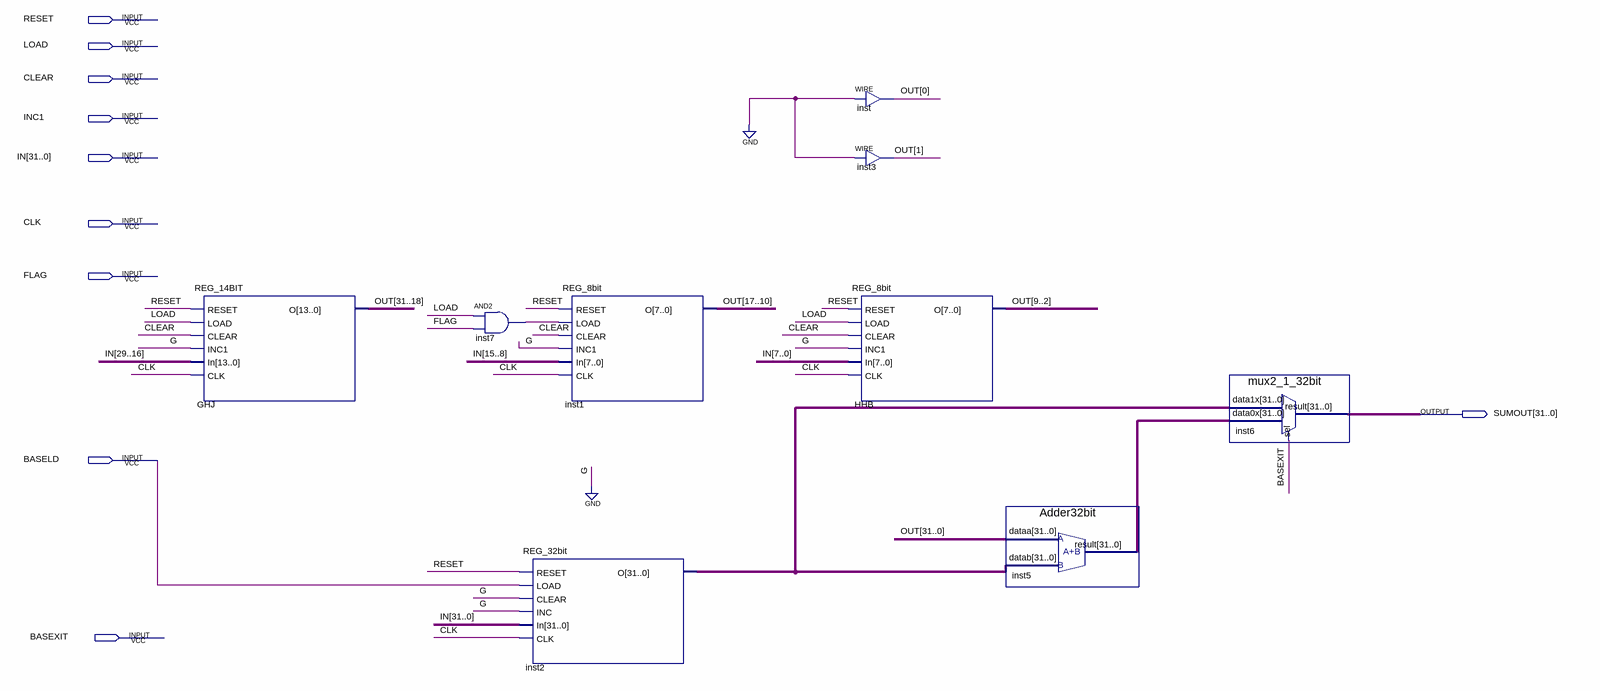
[diagram p0: schematic sheet]
// Quartus schematic LV.bdf as structural Verilog: 9 symbols, 10 pins
module LV (
  input  RESET,
  input  LOAD,
  input  CLEAR,
  input  INC1,
  input  [31:0] IN,
  input  CLK,
  input  FLAG,
  input  BASELD,
  input  BASEXIT,
  output [31:0] SUMOUT
);

  wire inst7_out;
  wire [31:0] inst2_o, inst5_result, OUT;

  REG_14BIT GHJ (.RESET(RESET), .LOAD(LOAD), .CLEAR(CLEAR), .INC1(1'b0), .In(IN[29:16]), .CLK(CLK), .O(OUT[31:18]));
  and inst7 (inst7_out, LOAD, FLAG);
  REG_32bit inst2 (.RESET(RESET), .LOAD(BASELD), .CLEAR(1'b0), .INC(1'b0), .In(IN), .CLK(CLK), .O(inst2_o));
  REG_8bit inst1 (
    .RESET(RESET), .LOAD(inst7_out), .CLEAR(CLEAR), .INC1(1'b0), .In(IN[15:8]), .CLK(CLK), .O(OUT[17:10]));
  assign OUT[0] = 1'b0;  // WIRE inst
  assign OUT[1] = 1'b0;  // WIRE inst3
  REG_8bit HHB (.RESET(RESET), .LOAD(LOAD), .CLEAR(CLEAR), .INC1(1'b0), .In(IN[7:0]), .CLK(CLK), .O(OUT[9:2]));
  Adder32bit inst5 (.dataa(OUT), .datab(inst2_o), .result(inst5_result));
  mux2_1_32bit inst6 (.data1x(inst2_o), .data0x(inst5_result), .sel(BASEXIT), .result(SUMOUT));
endmodule
